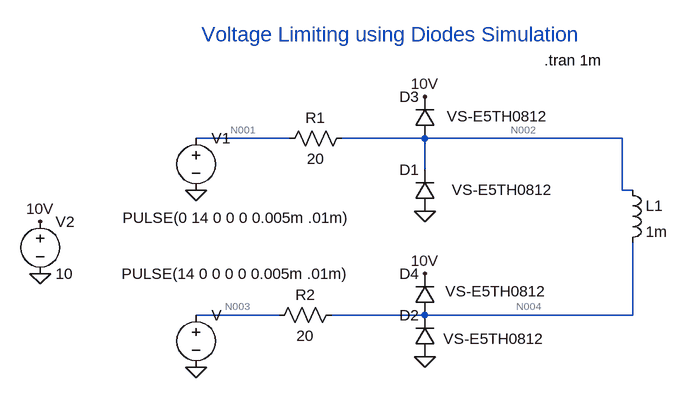
[diagram p0: schematic Diode Voltage Limiting.asc]
Diode Voltage Limiting.asc, the LTspice schematic file:
Version 4
SHEET 1 880 680
WIRE -48 48 -192 48
WIRE 160 48 32 48
WIRE 464 48 160 48
WIRE 160 96 160 48
WIRE 464 128 464 48
WIRE 480 128 464 128
WIRE -64 320 -192 320
WIRE 160 320 16 320
WIRE 480 320 480 208
WIRE 480 320 160 320
FLAG -192 128 0
FLAG -192 400 0
FLAG 160 384 0
FLAG 160 160 0
FLAG -432 256 0
FLAG -432 176 10V
FLAG 160 -16 10V
FLAG 160 256 10V
SYMBOL diode 176 160 R180
WINDOW 0 24 64 Left 2
WINDOW 3 -181 33 Left 2
SYMATTR InstName D1
SYMATTR Value VS-E5TH0812
SYMBOL diode 176 384 R180
WINDOW 0 24 64 Left 2
WINDOW 3 -168 28 Left 2
SYMATTR InstName D2
SYMATTR Value VS-E5TH0812
SYMBOL voltage -192 32 R0
WINDOW 3 -113 138 Left 2
WINDOW 123 0 0 Left 0
WINDOW 39 0 0 Left 0
SYMATTR Value PULSE(0 14 0 0 0 0.005m .01m)
SYMATTR InstName V1
SYMBOL voltage -192 304 R0
WINDOW 3 -115 -48 Left 2
WINDOW 123 0 0 Left 0
WINDOW 39 0 0 Left 0
SYMATTR Value PULSE(14 0 0 0 0 0.005m .01m)
SYMATTR InstName V
SYMBOL res 48 32 R90
WINDOW 0 0 56 VBottom 2
WINDOW 3 32 56 VTop 2
SYMATTR InstName R1
SYMATTR Value 20
SYMBOL res 32 304 R90
WINDOW 0 0 56 VBottom 2
WINDOW 3 32 56 VTop 2
SYMATTR InstName R2
SYMATTR Value 20
SYMBOL diode 176 48 R180
WINDOW 0 24 64 Left 2
WINDOW 3 -173 34 Left 2
SYMATTR InstName D3
SYMATTR Value VS-E5TH0812
SYMBOL diode 176 320 R180
WINDOW 0 24 64 Left 2
WINDOW 3 -171 37 Left 2
SYMATTR InstName D4
SYMATTR Value VS-E5TH0812
SYMBOL voltage -432 160 R0
WINDOW 123 0 0 Left 0
WINDOW 39 0 0 Left 0
SYMATTR InstName V2
SYMATTR Value 10
SYMBOL ind 464 112 R0
SYMATTR InstName L1
SYMATTR Value 1m
TEXT 344 -72 Left 2 !.tran 1m
TEXT -184 -112 Left 3 ;Voltage Limiting using Diodes Simulation

The netlist it stands for:
* Diode Voltage Limiting.asc
D1 0 N002 VS-E5TH0812
D2 0 N004 VS-E5TH0812
V1 N001 0 PULSE(0 14 0 0 0 0.005m .01m)
V N003 0 PULSE(14 0 0 0 0 0.005m .01m)
R1 N002 N001 20
R2 N004 N003 20
D3 N002 10V VS-E5TH0812
D4 N004 10V VS-E5TH0812
V2 10V 0 10
L1 N002 N004 1m
.model D D
.lib standard.dio
.tran 1m
* Voltage Limiting using Diodes Simulation
.backanno
.end

* Results of the author's LTspice run, read from the files saved beside the schematic
* Operating Point, zero values left out:
*   V(n002) = 7 V
*   V(n004) = 7 V
*   V(n003) = 14 V
*   V(10v) = 10 V
*   I(D1) = -50 µA
*   I(D2) = -50 µA
*   I(D3) = -50 µA
*   I(D4) = -50 µA
*   I(L1) = -350 mA
*   I(R1) = 350 mA
*   I(R2) = -350 mA
*   I(V1) = 350 mA
*   I(V) = -350 mA
*   I(V2) = -100 µA
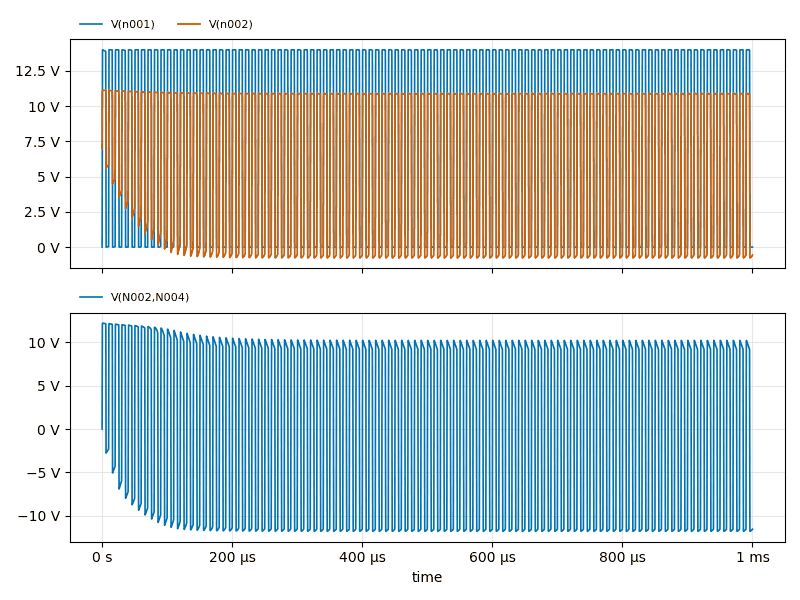
[diagram p1: Transient Analysis of Diode Voltage Limiting.asc, plotted from the saved traces]
* Transient Analysis, 1 run:
*   V(n001): min 0 V, max 14 V, average 7.7 V, rms 10.22 V, last 0 V
*   V(n002): min -774.6 mV, max 11.15 V, average 5.921 V, rms 8.072 V, last -561.8 mV
*   V(N002,N004): min -11.79 V, max 12.2 V, average 385.4 mV, rms 10.36 V, last -11.54 V